# EAGLE schematic Panel Frontal (EAGLE 9.6.2)
VERSION: 1.0
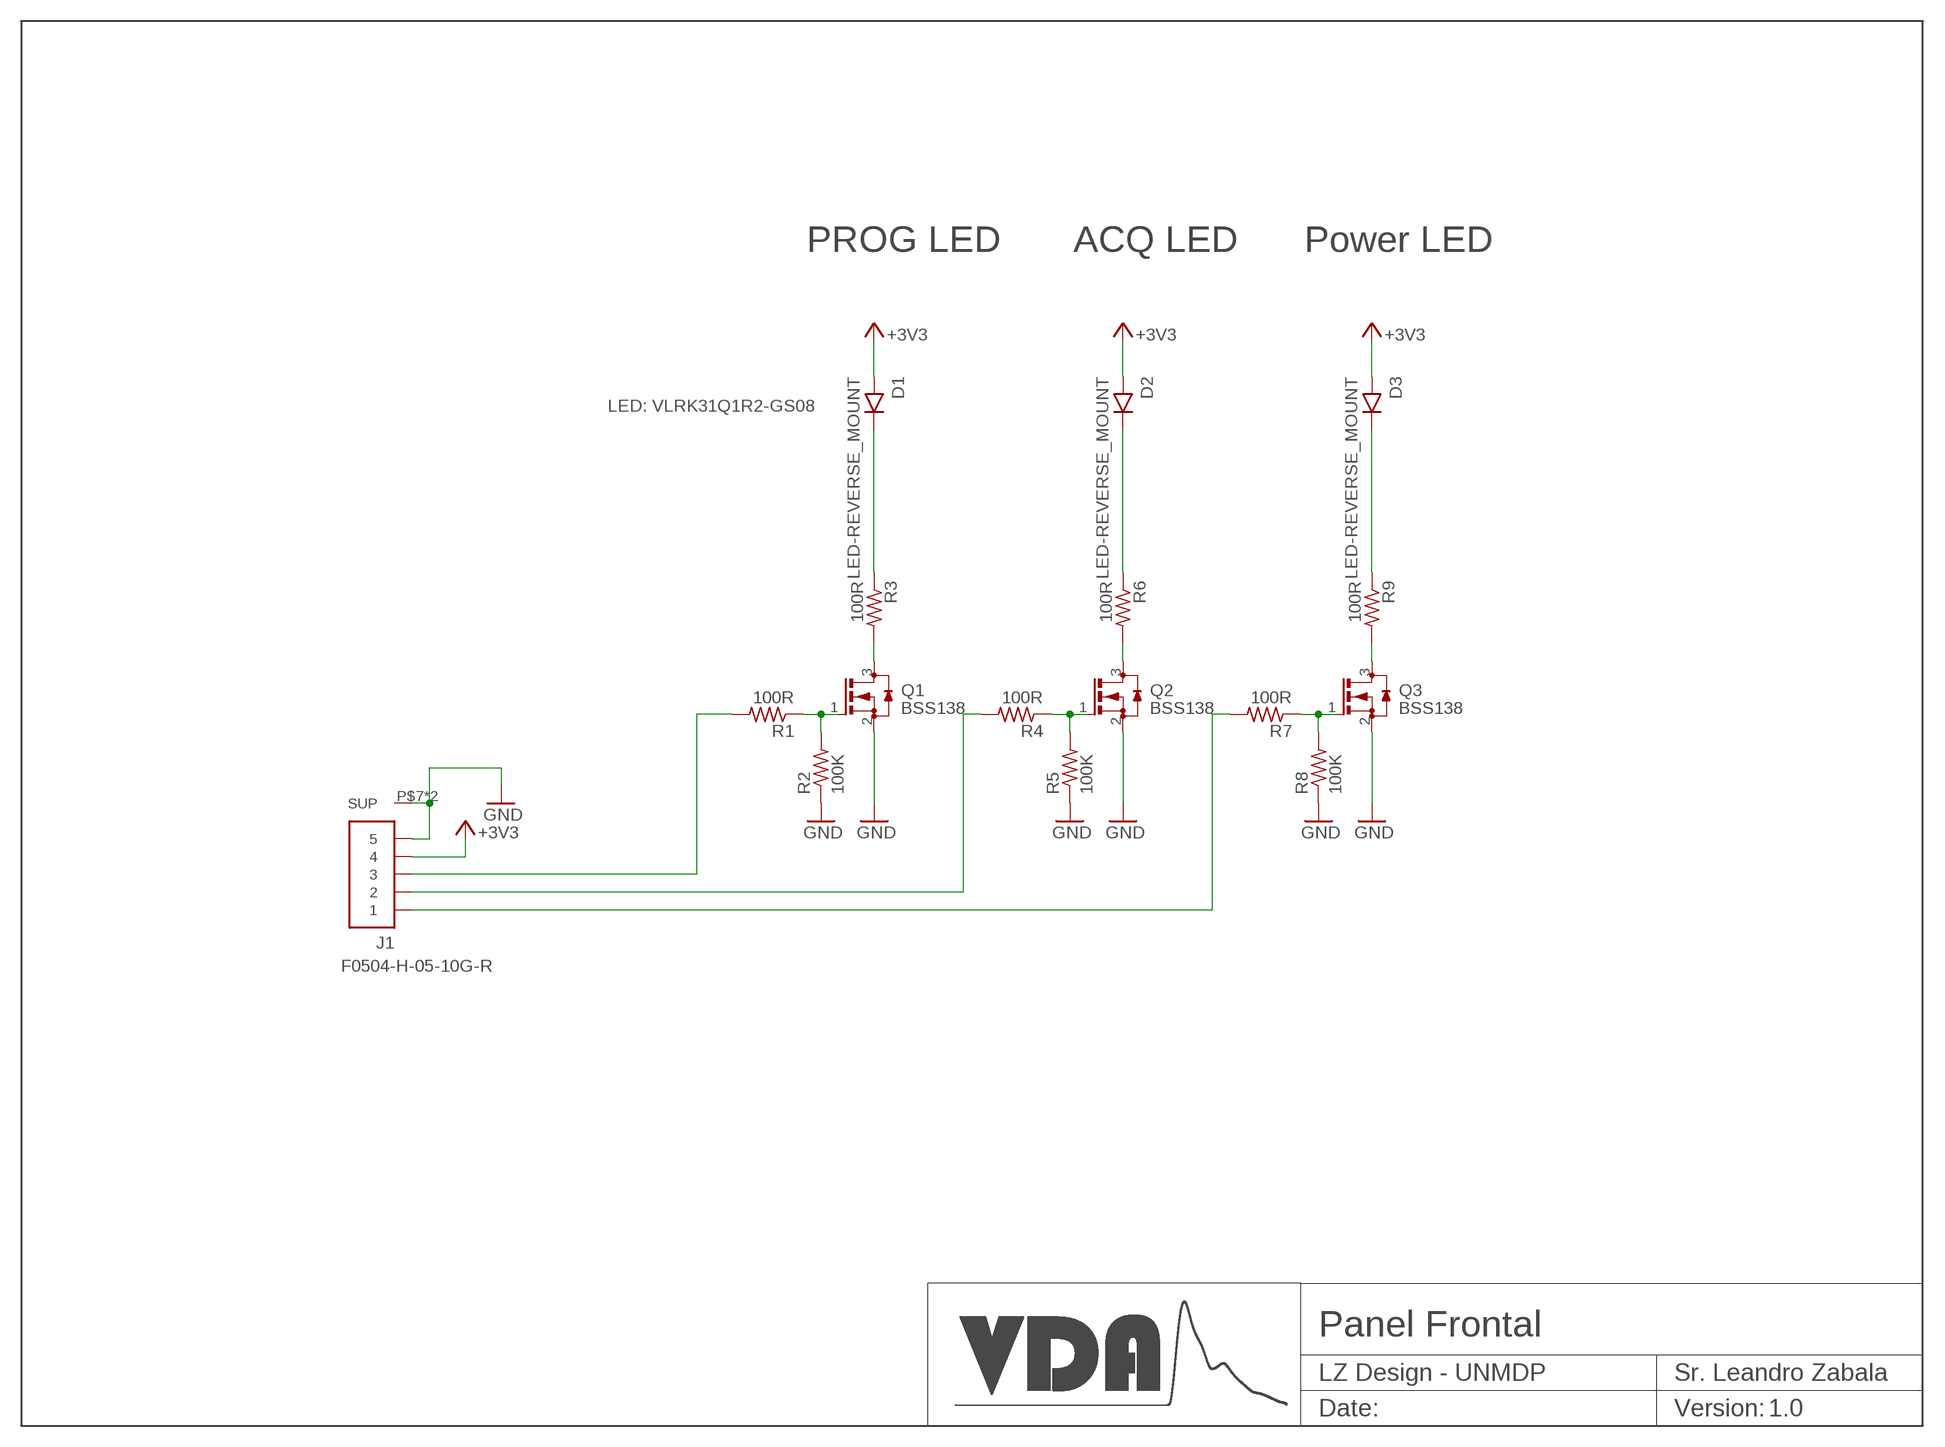
[diagram p0: schematic, sheet 1]

## Parts
D1  LED-REVERSE_MOUNT  [VLRK31]
D2  LED-REVERSE_MOUNT  [VLRK31]
D3  LED-REVERSE_MOUNT  [VLRK31]
J1  F0504-H-05-10G-R  [F0504-H-05-10G-R]
Q1  BSS138  N-MOS_SOT23-3  [SOT-23]
Q2  BSS138  N-MOS_SOT23-3  [SOT-23]
Q3  BSS138  N-MOS_SOT23-3  [SOT-23]
R1  100R  R_0603  [R_0603]
R2  100K  R_0603  [R_0603]
R3  100R  R_0603  [R_0603]
R4  100R  R_0603  [R_0603]
R5  100K  R_0603  [R_0603]
R6  100R  R_0603  [R_0603]
R7  100R  R_0603  [R_0603]
R8  100K  R_0603  [R_0603]
R9  100R  R_0603  [R_0603]

## Nets
+3V3: D1.A D2.A D3.A J1.P$4
GND: J1.P$5 J1.P$7(SUP) J1.P$8(SUP) Q1.2(S) Q2.2(S) Q3.2(S) R2.1 R5.1 R8.1
N$1: D2.K R6.1
N$2: D1.K R3.1
N$3: Q1.1(G) R1.1 R2.2
N$4: Q2.1(G) R4.1 R5.2
N$5: Q2.3(D) R6.2
N$6: Q3.1(G) R7.1 R8.2
N$7: J1.P$3 R1.2
N$8: J1.P$2 R4.2
N$9: J1.P$1 R7.2
N$10: Q1.3(D) R3.2
N$11: D3.K R9.1
N$12: Q3.3(D) R9.2

## Notes on the sheet
- PROG LED | ACQ LED | Power LED
- LED: VLRK31Q1R2-GS08

## Library data of the parts
D1-D3 = property_LED:LED-REVERSE_MOUNT
J1 = property-connectors:F0504-H-05-10G-R: FFC, FPC (Flat Flexible) Connector SMD,P=0.5mm,Surface Mount，Right Angle
Q1-Q3 = Property-standar:N-MOS
R1-R9 = Property-standar:R